# EAGLE design FitFullBoard (EAGLE 8.6.1)
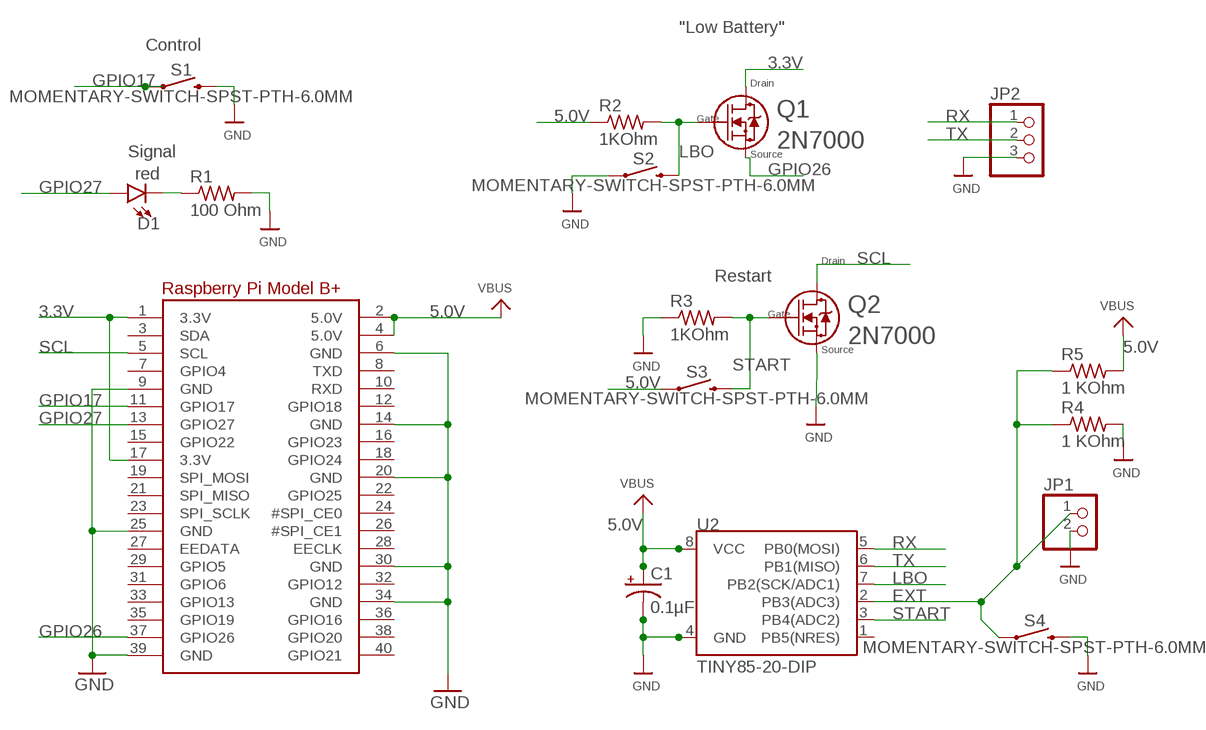
[diagram p0: schematic, sheet 1]

## Parts
C1  0.1µF  CPOL-USE2.5-4V  [E2,5RE]
D1  red  LED5MM  [LED_5MM]
JP1  HEADER-1X2  [1X02_OVAL]
JP2  PINHD-1X3CB  [1X03-CLEANBIG]
Q1  2N7000  [TO-92]
Q2  2N7000  [TO-92]
R1  100 Ohm  FLIPFLOP-RES  [0805-THM]
R2  1KOhm  FLIPFLOP-RES  [0805-THM]
R3  1KOhm  FLIPFLOP-RES  [0805-THM]
R4  1 KOhm  FLIPFLOP-RES  [0805-THM]
R5  1 KOhm  FLIPFLOP-RES  [0805-THM]
RPI1  RASPBERRYPI_BPLUS_BONNETNODIM  [PI_BONNET_NODIM]
S1  MOMENTARY-SWITCH-SPST-PTH-6.0MM  [TACTILE_SWITCH_PTH_6.0MM]
S2  MOMENTARY-SWITCH-SPST-PTH-6.0MM  [TACTILE_SWITCH_PTH_6.0MM]
S3  MOMENTARY-SWITCH-SPST-PTH-6.0MM  [TACTILE_SWITCH_PTH_6.0MM]
S4  MOMENTARY-SWITCH-SPST-PTH-6.0MM  [TACTILE_SWITCH_PTH_6.0MM]
U2  TINY85-20-DIP  ATTINY45TINY85-20-DIP  [DIP08_MCU]

## Nets
3.3V: Q1.3 RPI1.1(3.3V) RPI1.17(3.3V)
5.0V: C1.+ R2.1 R5.2 RPI1.2(5.0V) RPI1.4(5.0V) S3.1 U2.8(VCC) ; supply symbol labelled VBUS
EXT: JP1.1 R4.1 R5.1 S4.1 U2.2(PB3(ADC3))
GND: C1.- JP1.2 JP2.3 Q2.1 R1.2 R3.1 R4.2 RPI1.6(GND) RPI1.9(GND) RPI1.14(GND) RPI1.20(GND) RPI1.25(GND) RPI1.30(GND) RPI1.34(GND) RPI1.39(GND) S1.3 S2.1 S4.3 U2.4(GND)
GPIO17: RPI1.11(GPIO17) S1.1
GPIO26: Q1.1 RPI1.37(GPIO26)
GPIO27: D1.A RPI1.13(GPIO27)
LBO: Q1.2 R2.2 S2.3 U2.7(PB2(SCK/ADC1))
N$1: D1.K(C) R1.1
RX: JP2.1 U2.5(PB0(MOSI))
SCL: Q2.3 RPI1.5(SCL)
START: Q2.2 R3.2 S3.3 U2.3(PB4(ADC2))
TX: JP2.2 U2.6(PB1(MISO))
Unconnected: RPI1.3(SDA) RPI1.7(GPIO4) RPI1.8(TXD) RPI1.10(RXD) RPI1.12(GPIO18) RPI1.15(GPIO22) RPI1.16(GPIO23) RPI1.18(GPIO24) RPI1.19(SPI_MOSI) RPI1.21(SPI_MISO) RPI1.22(GPIO25) RPI1.23(SPI_SCLK) RPI1.24(#SPI_CE0) RPI1.26(#SPI_CE1) RPI1.27(EEDATA) RPI1.28(EECLK) RPI1.29(GPIO5) RPI1.31(GPIO6) RPI1.32(GPIO12) RPI1.33(GPIO13) RPI1.35(GPIO19) RPI1.36(GPIO16) RPI1.38(GPIO20) RPI1.40(GPIO21) U2.1(PB5(NRES))

## Notes on the sheet
- "Low Battery"
- Control
- Drain
- Gate
- Signal | Source
- Drain
- Restart
- Gate
- Source

## Library data of the parts
C1 = adafruit:CPOL-US: POLARIZED CAPACITOR, American symbol
D1 = SparkFun-LED:LED: LED (Generic) Standard schematic elements and footprints for 5mm, 3mm, 1206, and 0603 sized LEDs. Generic LEDs with no color specified.
JP1 = microbuilder:HEADER-1X2: PIN HEADER
JP2 = adafruit:PINHD-1X3: PIN HEADER
Q1 Q2 = imp-2n7000:2N7000; MANUFACTURER_PART_NUMBER: 2N7000; VENDOR: STMicroelectronics
R1-R5 = adafruit:FLIPFLOP-RES: Flip Flop resistor An 0805 resistor inside a standard 1/4W 5% resistor. Makes for easy mods
RPI1 = microbuilder:RASPBERRYPI_BPLUS
S1-S4 = SparkFun-Switches:MOMENTARY-SWITCH-SPST: Momentary Switch (Pushbutton) - SPST Normally-open (NO) SPST momentary switches (buttons, pushbuttons). Variants PTH-12MM - 12mm square, through-hole Momentary Pushbutton Switch - 12mm Square <https://www.sparkfun.com/products/9190> (COM-09190) PTH-6.0MM, PTH-6.0MM-KIT - 6.0mm square, through-hole Mini Pushbutton Switch <https://www.sparkfun.com/products/97> (COM-00097) KIT package intended for soldering kit's - only one side of pads' copper is exposed. PTH-RIGHT-ANGLE-KIT - Right-angle, through-hole Right Angle Tactile Button <https://www.sparkfun.com/products/10791> - Used on SparkFun BigTime Watch Kit <https://www.sparkfun.com/products/11734> SMD-12MM - 12mm square, surface-mount Tactile Button - SMD (12mm) <https://www.sparkfun.com/products/12993> (COM-12993) Used on SparkFun PicoBoard <https://www.sparkfun.com/products/11888> SMD-4.5MM - 4.5mm Square Trackball Switch Used on SparkFun Blackberry Trackballer Breakout <https://www.sparkfun.com/products/13169> SMD-4.6MMX2.8MM - 4.60mm x 2.80mm, surface mount Used on SparkFun SAMD21 Mini Breakout <https://www.sparkfun.com/products/13664> SMD-5.2MM, SMD-5.2-REDUNDANT - 5.2mm square, surface-mount Mini Pushbutton Switch - SMD <https://www.sparkfun.com/products/8720> (COM-08720) Used on Arduino Pro Mini <https://www.sparkfun.com/products/11114> REDUNDANT package connects both switch circuits together SMD-6.0X3.5MM - 6.0 x 3.5mm, surface mount Momentary Reset Switch SMD <https://www.sparkfun.com/products/8229> (COM-08229) SMD-6.2MM-TALL - 6.2mm square, surface mount Tactile Button - SMD (6mm) <https://www.sparkfun.com/products/12992> Used on SparkFun Digital Sandbox <https://www.sparkfun.com/products/12651> SMD-RIGHT-ANGLE - Right-angle, surface mount Used on SparkFun Block for Intel® Edison - Arduino <https://www.sparkfun.com/products/13036>; PROD_ID: SWCH-08441; SF_SKU: COM-00097
U2 = SparkFun-Retired:ATTINY45: Atmel 8-pin 2/4/8kB flash uC Retired; PROD_ID: IC-09445

## Board
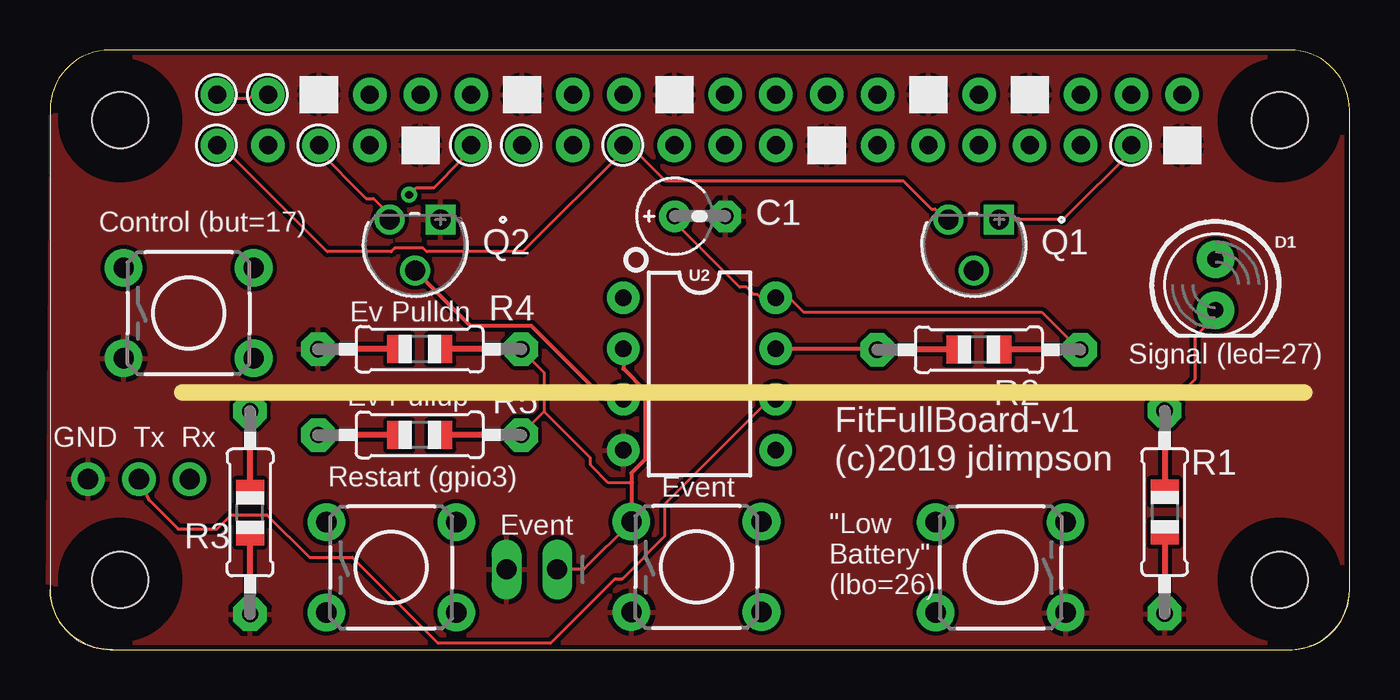
[diagram p1: board, top side]
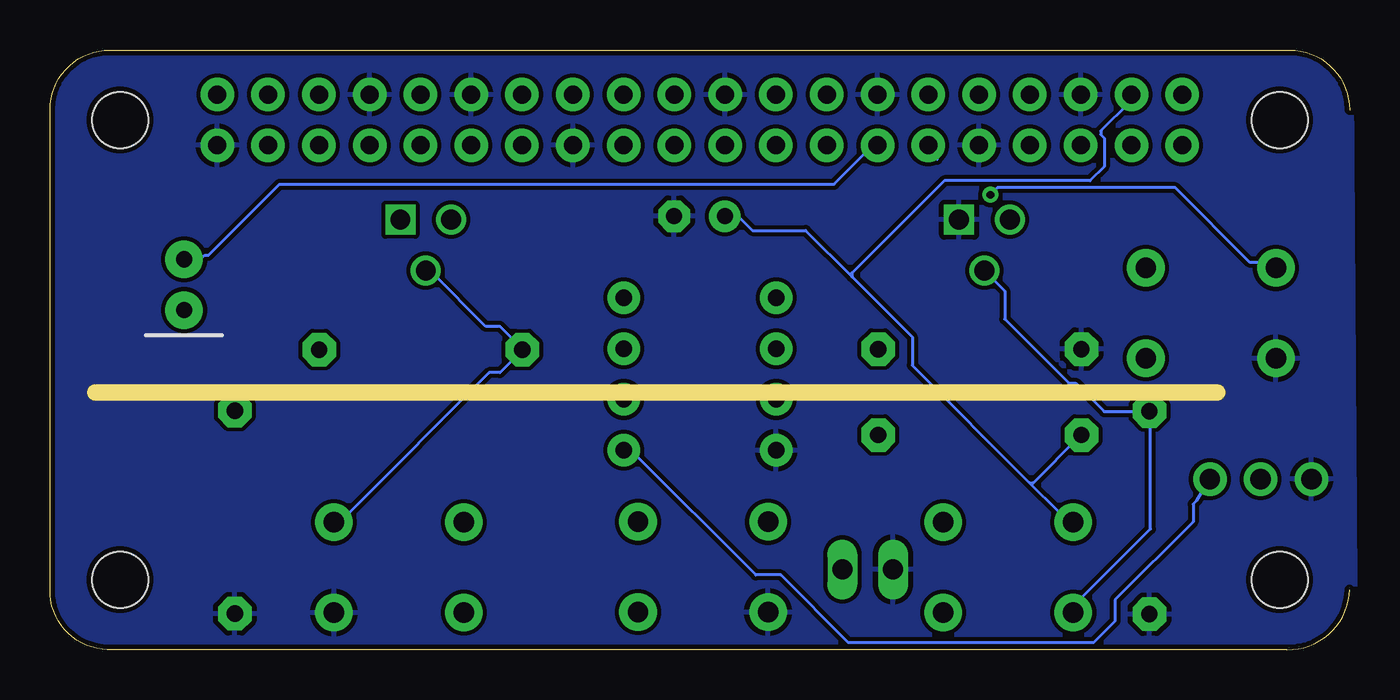
[diagram p2: board, bottom side, seen from below]

Size 65 x 30 mm. Coordinates in mm from the lower left corner, seen from the top.
Outline: 0,27 arc-90 3,30 62,30 arc-90 65,27 65,3 arc-90 62.13,0 3.13,0 arc-90 0,3
Copper layers (1*16): Top 0.035mm / dielectric 1.5mm / Bottom 0.035mm
Design rules "adafruit 7-7": minimum track width 6mil, minimum drill 15.5mil, track to track 8mil, track to pad 7mil, pad to pad 7mil, via to via 7mil, smd to smd 7mil, copper to edge 10mil, drill to drill 8mil, minimum pad ring 10mil, minimum via ring 8mil, stop-mask expansion 2mil, vias tented up to drill 20mil, thermal gap 10mil
Milling: 1 lines

### Footprints (pad centres in the part's own frame; a part is rotated, then mirrored left to right if it is on the bottom)
E2,5RE = drill 0.813 pad 1.575: + -1.27,0 | drill 0.813 pad 1.575 octagon: - 1.27,0
LED_5MM = drill 0.813 pad 1.88: A -1.27,0; K 1.27,0
1X02_OVAL = drill 1 long: 1 -1.27,0; 2 1.27,0
1X03-CLEANBIG = drill 1.016 pad 1.676: 1 -2.54,0; 2 0,0; 3 2.54,0
TO-92 = drill 0.991 pad 1.499 square: 1 -2.54,-2.54 | drill 0.991 pad 1.499: 2 -1.27,0; 3 0,-2.54
0805-THM = drill 0.813 pad 1.676 octagon: 1 -5.08,0; 2 5.08,0
PI_BONNET_NODIM = drill 0.9 pad 1.676: 1 8.37,25.23; 2 8.37,27.77; 3 10.91,25.23; 4 10.91,27.77; 5 13.45,25.23; 6 13.45,27.77; 7 15.99,25.23; 8 15.99,27.77; 9 18.53,25.23; 10 18.53,27.77; 11 21.07,25.23; 12 21.07,27.77; 13 23.61,25.23; 14 23.61,27.77; 15 26.15,25.23; 16 26.15,27.77; 17 28.69,25.23; 18 28.69,27.77; 19 31.23,25.23; 20 31.23,27.77; 21 33.77,25.23; 22 33.77,27.77; 23 36.31,25.23; 24 36.31,27.77; 25 38.85,25.23; 26 38.85,27.77; 27 41.39,25.23; 28 41.39,27.77; 29 43.93,25.23; 30 43.93,27.77; 31 46.47,25.23; 32 46.47,27.77; 33 49.01,25.23; 34 49.01,27.77; 35 51.55,25.23; 36 51.55,27.77; 37 54.09,25.23; 38 54.09,27.77; 39 56.63,25.23; 40 56.63,27.77 | hole 2.8: 3.5,3.5; 3.5,26.5; 61.5,26.5; 61.5,3.5
TACTILE_SWITCH_PTH_6.0MM = drill 1.016 pad 1.88: 1 -3.251,2.261; 2 3.251,2.261; 3 -3.251,-2.261; 4 3.251,-2.261
DIP08_MCU = drill 0.813 pad 1.626: 1 -3.81,-3.81; 2 -1.27,-3.81; 3 1.27,-3.81; 4 3.81,-3.81; 5 3.81,3.81; 6 1.27,3.81; 7 -1.27,3.81; 8 -3.81,3.81

### Placement (x,y rotation side)
C1  32.51,21.68 0 top
D1  58.29,18.25 270 top
JP1  24.1,4.01 180 top
JP2  4.45,8.53 180 top
Q1  44.93,18.97 180 top
Q2  16.99,18.97 180 top
R1  55.75,6.88 270 top
R2  46.46,15 180 top
R3  10.01,6.85 90 top
R4  18.49,15.03 180 top
R5  18.49,10.74 180 top
RPI1  0,0 0 top
S1  6.93,16.83 0 top
S2  47.55,4.11 180 top
S3  17.07,4.11 0 top
S4  32.33,4.13 0 top
U2  32.49,13.78 270 top

### Tracks (layer width: path | path; a pad name or v marks a point on that pad's centre or on a via)
3.3V
  Top 0.152: 28.8,25.06 29.16,25.06 30.76,23.46 42.67,23.46 44.09,22.04 44.27,22.04 44.81,21.51 Q1.3 | 28.8,25.06 23.65,19.91 18.85,19.91 18.67,20.08 17.25,20.08 17.07,19.91 13.87,19.91 8.71,25.06 8.53,25.06 RPI1.1 | 28.8,25.06 RPI1.17
5.0V
  Top 0.152: RPI1.2 8.53,27.73 9.07,27.73 9.25,27.55 9.96,27.55 10.13,27.73 10.85,27.73 RPI1.4 | C1.+ 31.29,21.68 31.29,21.33 34.49,18.13 34.85,18.13 35.2,17.77 35.38,17.77 35.56,17.59 U2.8 36.98,17.59 37.69,16.88 49.61,16.88 51.03,15.46 51.21,15.46 51.56,15.11 R2.1 | 13.69,6.22 S3.1
  Bottom 0.152: 16,8.35 21.87,14.22 21.87,15.64 24.89,18.66 | 16,8.35 14.58,6.93 14.4,6.93 13.87,6.39 S3.1 | 24.89,18.66 27.2,20.97 29.87,20.97 30.58,21.68 C1.+ | 16,8.35 15.82,8.35 13.51,10.66 R5.2 | 24.89,18.66 24.89,18.84 20.27,23.46 12.98,23.46 12.27,24.17 12.27,25.6 12.45,25.77 12.45,25.95 11.02,27.37 11.02,27.73 RPI1.4
EXT
  Top 0.152: 28.98,6.39 S4.1 26.7,4.01 JP1.1 | 24.71,11.91 23.65,10.84 R5.1 | 24.71,11.91 24.71,13.86 23.65,14.93 R4.1 | 24.71,11.91 27.03,9.59 27.03,9.24 27.91,8.35 29.08,8.35 29.16,8.35
  Top 0.203: U2.2 28.68,14.06 29.77,12.97 29.77,9.52 29.08,8.84 29.08,8.35 S4.1
GND
  pour Bottom: -0.05,31.79 -0.3,-3.87 64.72,-3.87 65.1,31.79
  pour Top: 0.1,31.79 -0.15,-3.87 64.87,-3.87 65.25,31.79
GPIO17  (via drill 0.39)
  Top 0.152: v17.96,22.75 18.31,23.11 19.2,23.11 20.62,24.53 20.62,24.71 20.98,25.06 RPI1.11
  Bottom 0.152: 20.62,24.53 20.62,24.71 20.98,25.06 RPI1.11 | v17.96,22.75 17.6,23.11 8.71,23.11 4.98,19.37 3.91,19.37 3.73,19.19 S1.1
GPIO26
  Top 0.152: Q1.1 50.67,21.51 54.23,25.06 RPI1.37
GPIO27
  Bottom 0.152: RPI1.13 23.65,25.06 24,25.06 25.78,23.28 53.52,23.28 57.07,19.73 57.25,19.73 57.43,19.55 58.14,19.55 D1.A
LBO
  Top 0.203: U2.7 40.76,15.05 41.17,15.46 41.38,15.46 R2.2
  Bottom 0.152: Q1.2 46.05,18.84 45.87,18.84 43.2,16.17 42.49,16.17 41.43,15.11 R2.2 41.43,14.93 42.49,13.86 43.03,13.86 50.14,6.75 50.32,6.75 50.67,6.39 S2.3
N$1
  Top 0.152: R1.1 55.83,12.08 57.25,13.51 57.25,15.64 58.14,16.53 58.14,16.88 D1.K
RX
  Bottom 0.152: U2.5 36.27,9.95 35.92,9.95 29.69,3.73 28.45,3.73 25.07,0.35 12.8,0.35 11.73,1.41 11.73,2.48 7.82,6.39 7.82,7.28 7.64,7.46 JP2.1
SCL
  Top 0.152: Q2.3 16.89,21.51 16.89,21.86 16.18,22.57 15.82,22.57 13.34,25.06 RPI1.5
START
  Top 0.203: U2.3 27.77,12.51 24.09,16.2 21.03,16.2 Q2.2
  Bottom 0.152: S3.3 13.69,1.95 13.69,2.3 9.96,6.04 9.96,11.91 R3.2 10.13,11.91 12.27,11.91 13.69,13.33 14.05,13.33 17.25,16.53 17.25,17.95 Q2.2
TX
  Top 0.152: U2.6 36.27,12.44 35.92,12.44 30.76,7.28 30.76,5.68 28.63,3.55 28.27,3.55 25.07,0.35 19.38,0.35 15.11,4.62 12.98,4.62 10.85,6.75 9.07,6.75 8.36,6.04 6.4,6.04 4.98,7.46 JP2.2

### Text on the board
tPlace: Control (but=17) | Ev Pulldn | Signal (led=27) | Ev Pullup | GND Tx Rx | FitFullBoard-v1 / (c)2019 jdimpson | Restart (gpio3) | Event | Event | "Low / Battery" / (lbo=26)